# EAGLE design SOT23-5 (EAGLE 7.1.0)
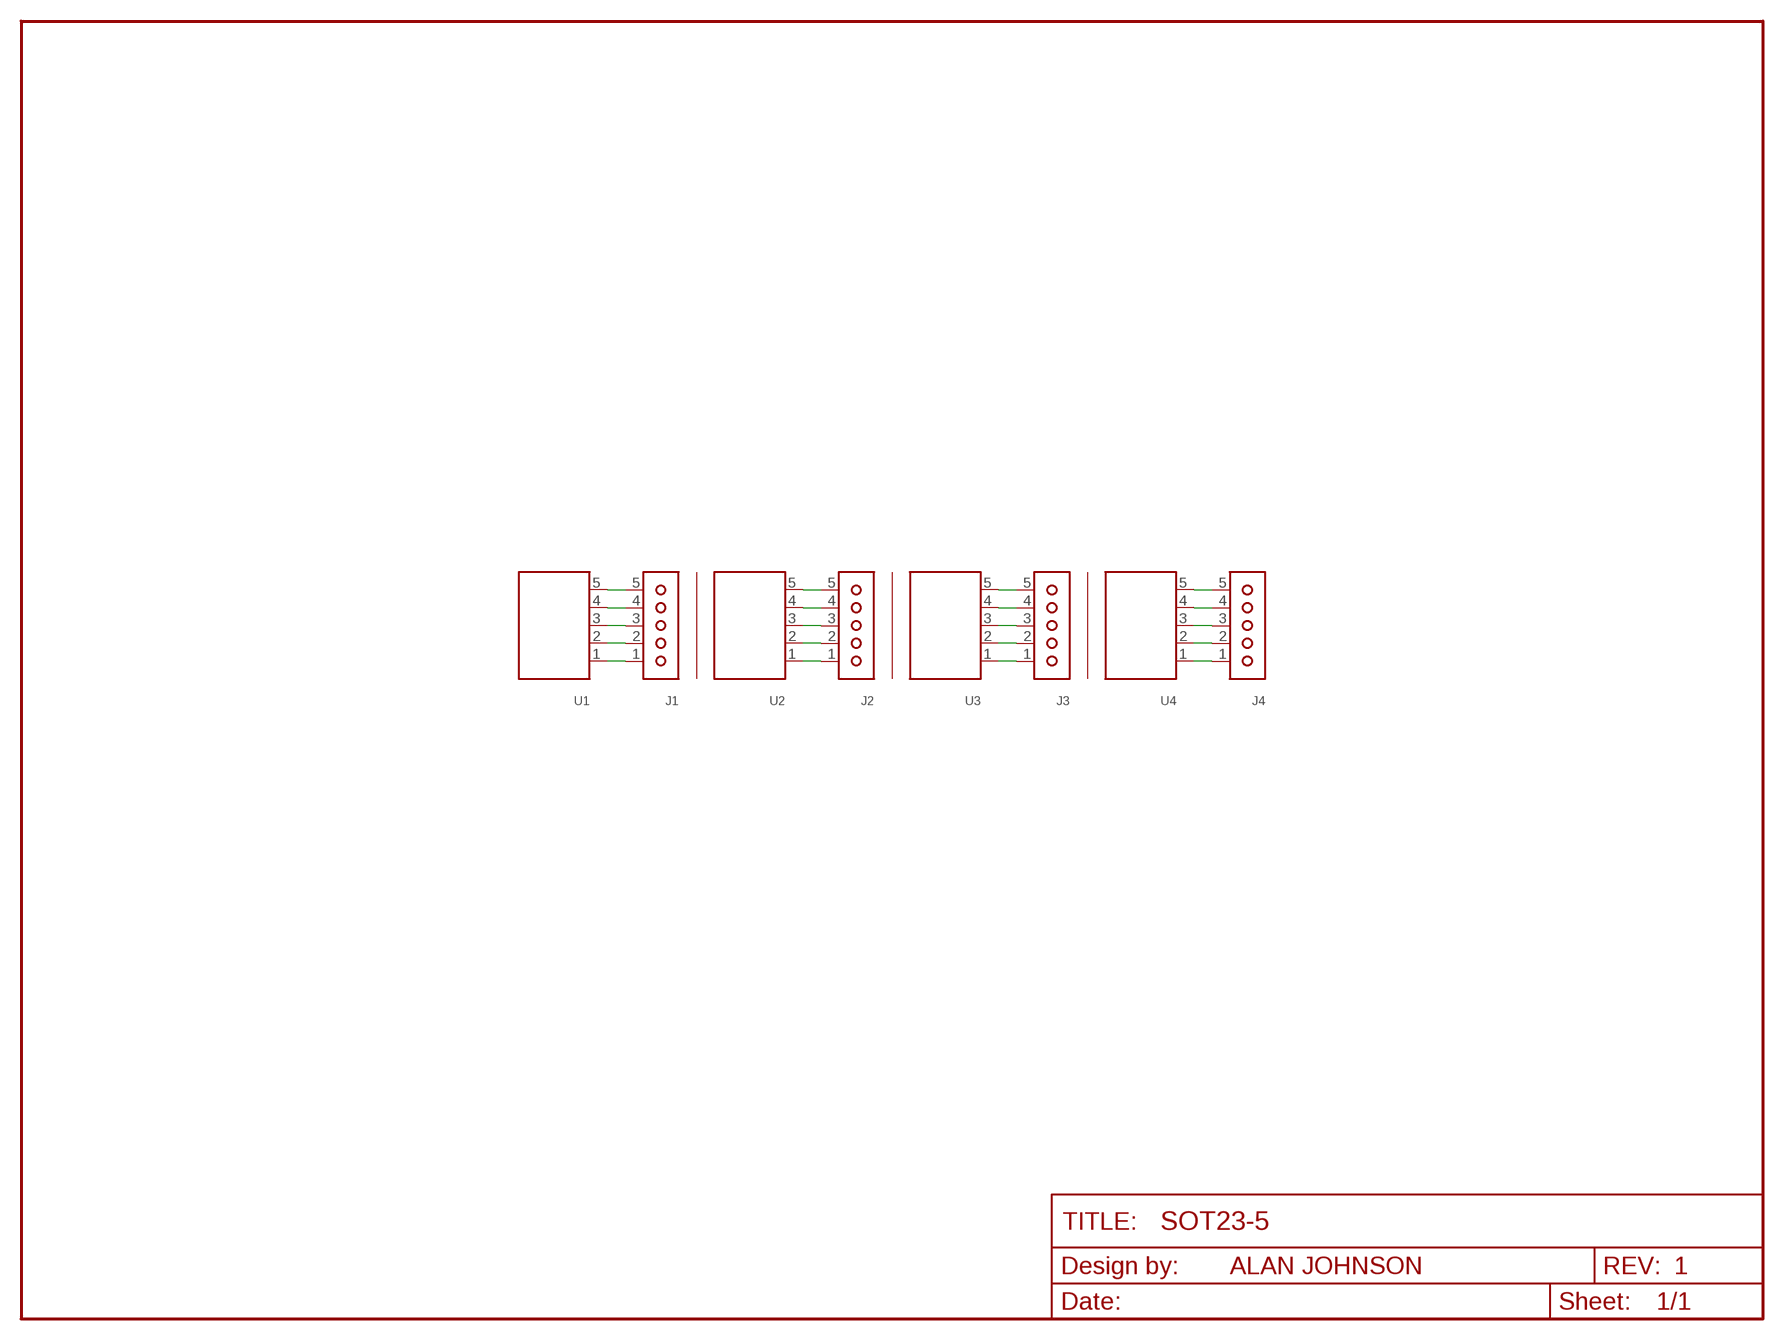
[diagram p0: schematic, sheet 1]

## Parts
J1  1X05  [1X05]
J2  1X05  [1X05]
J3  1X05  [1X05]
J4  1X05  [1X05]
U1  SOT23-5  [SOT23-5]
U2  SOT23-5  [SOT23-5]
U3  SOT23-5  [SOT23-5]
U4  SOT23-5  [SOT23-5]

## Nets
N$1: J1.1 U1.1
N$2: J1.2 U1.2
N$3: J1.3 U1.3
N$4: J2.1 U2.1
N$5: J2.2 U2.2
N$6: J2.3 U2.3
N$7: J3.1 U3.1
N$8: J3.2 U3.2
N$9: J3.3 U3.3
N$10: J4.1 U4.1
N$11: J4.2 U4.2
N$12: J4.3 U4.3
N$22: J1.4 U1.4
N$23: J1.5 U1.5
N$24: J2.4 U2.4
N$25: J2.5 U2.5
N$26: J3.4 U3.4
N$27: J3.5 U3.5
N$28: J4.4 U4.4
N$29: J4.5 U4.5

## Notes on the sheet
- ALAN JOHNSON | 1

## Library data of the parts
J1-J4 = breakouts:1X05: 1x05 Pin Headers
U1-U4 = breakouts:SOT23-5: Small Outline Transistor - 5 Leads

## Board
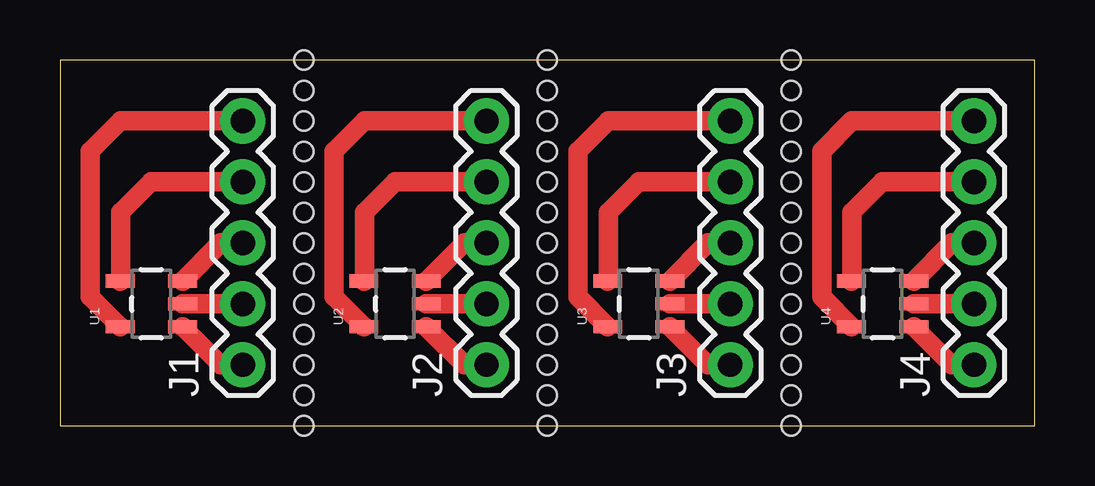
[diagram p1: board, top side]
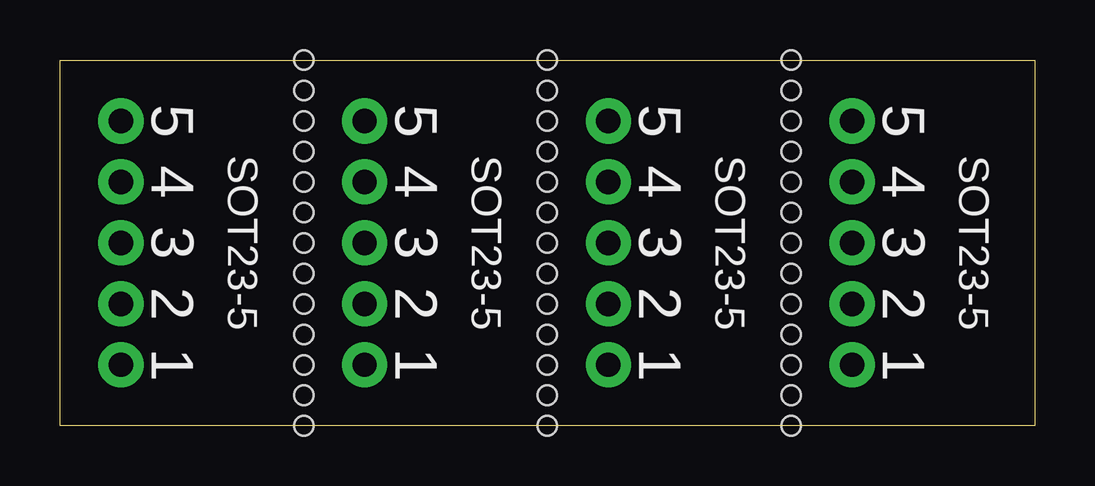
[diagram p2: board, bottom side, seen from below]

Size 40.64 x 15.24 mm. Coordinates in mm from the lower left corner, seen from the top.
Outline: 0,0 40.64,0 40.64,15.24 0,15.24 0,0
Copper layers (1*16): Top 0.0356mm / dielectric 1.5011mm / Bottom 0.0356mm
Design rules "breakouts *": minimum track width 6mil, minimum drill 13mil, track to track 6mil, track to pad 6mil, pad to pad 6mil, via to via 6mil, smd to smd 6mil, copper to edge 15mil, drill to drill 6mil, minimum pad ring 7mil, minimum via ring 7mil, stop-mask expansion 3mil, vias tented up to drill 0mil, thermal gap 10mil
Holes 0.8 mm at 10.16,10.16 10.16,8.89 10.16,7.62 10.16,6.35 10.16,5.08 10.16,3.81 10.16,2.54 10.16,1.27 10.16,0 20.32,10.16 20.32,8.89 20.32,7.62 20.32,6.35 20.32,5.08 20.32,3.81 20.32,2.54 20.32,1.27 20.32,0 30.48,10.16 30.48,8.89 30.48,7.62 30.48,6.35 30.48,5.08 30.48,3.81 30.48,2.54 30.48,1.27 30.48,0 10.16,11.43 10.16,12.7 10.16,13.97 10.16,15.24 20.32,11.43 20.32,12.7 20.32,13.97 20.32,15.24 30.48,11.43 30.48,12.7 30.48,13.97 30.48,15.24

### Footprints (pad centres in the part's own frame; a part is rotated, then mirrored left to right if it is on the bottom)
1X05 = drill 1.016 pad 1.88: 1 0,0; 2 2.54,0; 3 5.08,0; 4 7.62,0; 5 10.16,0
SOT23-5 = smd 0.55 x 1.2: 1 -0.95,-1.3; 2 0,-1.3; 3 0.95,-1.3; 4 0.95,1.3; 5 -0.95,1.3

### Placement (x,y rotation side)
J1  7.62,2.54 90 top
J2  17.78,2.54 90 top
J3  27.94,2.54 90 top
J4  38.1,2.54 90 top
U1  3.81,5.08 90 top
U2  13.97,5.08 90 top
U3  24.13,5.08 90 top
U4  34.29,5.08 90 top

### Tracks (layer width: path | path; a pad name or v marks a point on that pad's centre or on a via)
N$1
  Top 0.813: U1.1 6.7,2.54 J1.1
N$2
  Top 0.813: U1.2 J1.2
N$3
  Top 0.813: U1.3 6.7,7.62 J1.3
N$4
  Top 0.813: U2.1 16.86,2.54 J2.1
N$5
  Top 0.813: U2.2 J2.2
N$6
  Top 0.813: U2.3 16.86,7.62 J2.3
N$7
  Top 0.813: U3.1 27.02,2.54 J3.1
N$8
  Top 0.813: U3.2 J3.2
N$9
  Top 0.813: U3.3 27.02,7.62 J3.3
N$10
  Top 0.813: U4.1 37.18,2.54 J4.1
N$11
  Top 0.813: U4.2 J4.2
N$12
  Top 0.813: U4.3 37.18,7.62 J4.3
N$22
  Top 0.813: U1.4 2.54,6.06 2.54,8.89 3.81,10.16 J1.4
N$23
  Top 0.813: U1.5 1.27,5.37 1.27,11.43 2.54,12.7 J1.5
N$24
  Top 0.813: U2.4 12.7,6.06 12.7,8.89 13.97,10.16 J2.4
N$25
  Top 0.813: U2.5 11.43,5.37 11.43,11.43 12.7,12.7 J2.5
N$26
  Top 0.813: U3.4 22.86,6.06 22.86,8.89 24.13,10.16 J3.4
N$27
  Top 0.813: U3.5 21.59,5.37 21.59,11.43 22.86,12.7 J3.5
N$28
  Top 0.813: U4.4 33.02,6.06 33.02,8.89 34.29,10.16 J4.4
N$29
  Top 0.813: U4.5 31.75,5.37 31.75,11.43 33.02,12.7 J4.5

### Text on the board
bPlace: 5 | 5 | 5 | 5 | 4 | 4 | 4 | 4 | SOT23-5 | 3 | SOT23-5 | 3 | SOT23-5 | 3 | SOT23-5 | 3 | 2 | 2 | 2 | 2 | 1 | 1 | 1 | 1